# EAGLE schematic untitled (EAGLE 9.6.2)
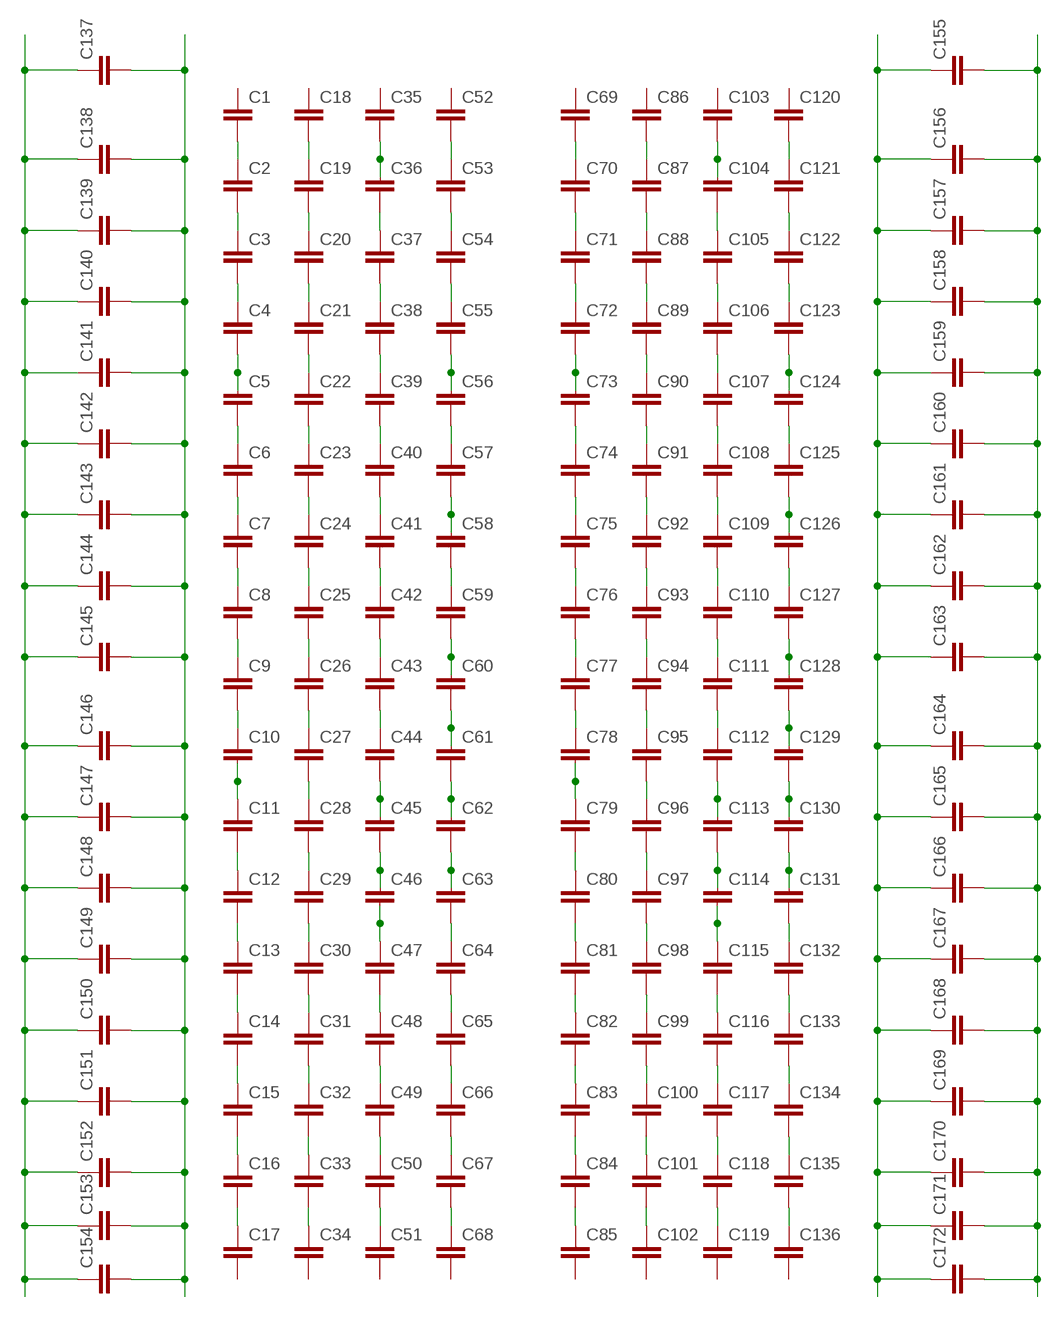
[diagram p0: schematic, sheet 1]

## Parts
C1  C2,5-3  [C2.5-3]
C2  C2,5-3  [C2.5-3]
C3  C2,5-3  [C2.5-3]
C4  C2,5-3  [C2.5-3]
C5  C2,5-3  [C2.5-3]
C6  C2,5-3  [C2.5-3]
C7  C2,5-3  [C2.5-3]
C8  C2,5-3  [C2.5-3]
C9  C2,5-3  [C2.5-3]
C10  C2,5-3  [C2.5-3]
C11  C2,5-3  [C2.5-3]
C12  C2,5-3  [C2.5-3]
C13  C2,5-3  [C2.5-3]
C14  C2,5-3  [C2.5-3]
C15  C2,5-3  [C2.5-3]
C16  C2,5-3  [C2.5-3]
C17  C2,5-3  [C2.5-3]
C18  C2,5-3  [C2.5-3]
C19  C2,5-3  [C2.5-3]
C20  C2,5-3  [C2.5-3]
C21  C2,5-3  [C2.5-3]
C22  C2,5-3  [C2.5-3]
C23  C2,5-3  [C2.5-3]
C24  C2,5-3  [C2.5-3]
C25  C2,5-3  [C2.5-3]
C26  C2,5-3  [C2.5-3]
C27  C2,5-3  [C2.5-3]
C28  C2,5-3  [C2.5-3]
C29  C2,5-3  [C2.5-3]
C30  C2,5-3  [C2.5-3]
C31  C2,5-3  [C2.5-3]
C32  C2,5-3  [C2.5-3]
C33  C2,5-3  [C2.5-3]
C34  C2,5-3  [C2.5-3]
C35  C2,5-3  [C2.5-3]
C36  C2,5-3  [C2.5-3]
C37  C2,5-3  [C2.5-3]
C38  C2,5-3  [C2.5-3]
C39  C2,5-3  [C2.5-3]
C40  C2,5-3  [C2.5-3]
C41  C2,5-3  [C2.5-3]
C42  C2,5-3  [C2.5-3]
C43  C2,5-3  [C2.5-3]
C44  C2,5-3  [C2.5-3]
C45  C2,5-3  [C2.5-3]
C46  C2,5-3  [C2.5-3]
C47  C2,5-3  [C2.5-3]
C48  C2,5-3  [C2.5-3]
C49  C2,5-3  [C2.5-3]
C50  C2,5-3  [C2.5-3]
C51  C2,5-3  [C2.5-3]
C52  C2,5-3  [C2.5-3]
C53  C2,5-3  [C2.5-3]
C54  C2,5-3  [C2.5-3]
C55  C2,5-3  [C2.5-3]
C56  C2,5-3  [C2.5-3]
C57  C2,5-3  [C2.5-3]
C58  C2,5-3  [C2.5-3]
C59  C2,5-3  [C2.5-3]
C60  C2,5-3  [C2.5-3]
C61  C2,5-3  [C2.5-3]
C62  C2,5-3  [C2.5-3]
C63  C2,5-3  [C2.5-3]
C64  C2,5-3  [C2.5-3]
C65  C2,5-3  [C2.5-3]
C66  C2,5-3  [C2.5-3]
C67  C2,5-3  [C2.5-3]
C68  C2,5-3  [C2.5-3]
C69  C2,5-3  [C2.5-3]
C70  C2,5-3  [C2.5-3]
C71  C2,5-3  [C2.5-3]
C72  C2,5-3  [C2.5-3]
C73  C2,5-3  [C2.5-3]
C74  C2,5-3  [C2.5-3]
C75  C2,5-3  [C2.5-3]
C76  C2,5-3  [C2.5-3]
C77  C2,5-3  [C2.5-3]
C78  C2,5-3  [C2.5-3]
C79  C2,5-3  [C2.5-3]
C80  C2,5-3  [C2.5-3]
C81  C2,5-3  [C2.5-3]
C82  C2,5-3  [C2.5-3]
C83  C2,5-3  [C2.5-3]
C84  C2,5-3  [C2.5-3]
C85  C2,5-3  [C2.5-3]
C86  C2,5-3  [C2.5-3]
C87  C2,5-3  [C2.5-3]
C88  C2,5-3  [C2.5-3]
C89  C2,5-3  [C2.5-3]
C90  C2,5-3  [C2.5-3]
C91  C2,5-3  [C2.5-3]
C92  C2,5-3  [C2.5-3]
C93  C2,5-3  [C2.5-3]
C94  C2,5-3  [C2.5-3]
C95  C2,5-3  [C2.5-3]
C96  C2,5-3  [C2.5-3]
C97  C2,5-3  [C2.5-3]
C98  C2,5-3  [C2.5-3]
C99  C2,5-3  [C2.5-3]
C100  C2,5-3  [C2.5-3]
C101  C2,5-3  [C2.5-3]
C102  C2,5-3  [C2.5-3]
C103  C2,5-3  [C2.5-3]
C104  C2,5-3  [C2.5-3]
C105  C2,5-3  [C2.5-3]
C106  C2,5-3  [C2.5-3]
C107  C2,5-3  [C2.5-3]
C108  C2,5-3  [C2.5-3]
C109  C2,5-3  [C2.5-3]
C110  C2,5-3  [C2.5-3]
C111  C2,5-3  [C2.5-3]
C112  C2,5-3  [C2.5-3]
C113  C2,5-3  [C2.5-3]
C114  C2,5-3  [C2.5-3]
C115  C2,5-3  [C2.5-3]
C116  C2,5-3  [C2.5-3]
C117  C2,5-3  [C2.5-3]
C118  C2,5-3  [C2.5-3]
C119  C2,5-3  [C2.5-3]
C120  C2,5-3  [C2.5-3]
C121  C2,5-3  [C2.5-3]
C122  C2,5-3  [C2.5-3]
C123  C2,5-3  [C2.5-3]
C124  C2,5-3  [C2.5-3]
C125  C2,5-3  [C2.5-3]
C126  C2,5-3  [C2.5-3]
C127  C2,5-3  [C2.5-3]
C128  C2,5-3  [C2.5-3]
C129  C2,5-3  [C2.5-3]
C130  C2,5-3  [C2.5-3]
C131  C2,5-3  [C2.5-3]
C132  C2,5-3  [C2.5-3]
C133  C2,5-3  [C2.5-3]
C134  C2,5-3  [C2.5-3]
C135  C2,5-3  [C2.5-3]
C136  C2,5-3  [C2.5-3]
C137  C2,5-3  [C2.5-3]
C138  C2,5-3  [C2.5-3]
C139  C2,5-3  [C2.5-3]
C140  C2,5-3  [C2.5-3]
C141  C2,5-3  [C2.5-3]
C142  C2,5-3  [C2.5-3]
C143  C2,5-3  [C2.5-3]
C144  C2,5-3  [C2.5-3]
C145  C2,5-3  [C2.5-3]
C146  C2,5-3  [C2.5-3]
C147  C2,5-3  [C2.5-3]
C148  C2,5-3  [C2.5-3]
C149  C2,5-3  [C2.5-3]
C150  C2,5-3  [C2.5-3]
C151  C2,5-3  [C2.5-3]
C152  C2,5-3  [C2.5-3]
C153  C2,5-3  [C2.5-3]
C154  C2,5-3  [C2.5-3]
C155  C2,5-3  [C2.5-3]
C156  C2,5-3  [C2.5-3]
C157  C2,5-3  [C2.5-3]
C158  C2,5-3  [C2.5-3]
C159  C2,5-3  [C2.5-3]
C160  C2,5-3  [C2.5-3]
C161  C2,5-3  [C2.5-3]
C162  C2,5-3  [C2.5-3]
C163  C2,5-3  [C2.5-3]
C164  C2,5-3  [C2.5-3]
C165  C2,5-3  [C2.5-3]
C166  C2,5-3  [C2.5-3]
C167  C2,5-3  [C2.5-3]
C168  C2,5-3  [C2.5-3]
C169  C2,5-3  [C2.5-3]
C170  C2,5-3  [C2.5-3]
C171  C2,5-3  [C2.5-3]
C172  C2,5-3  [C2.5-3]

## Nets
N$1: C1.2 C2.1
N$2: C2.2 C3.1
N$3: C3.2 C4.1
N$4: C4.2 C5.1
N$5: C16.2 C17.1
N$6: C15.2 C16.1
N$7: C14.2 C15.1
N$8: C13.2 C14.1
N$9: C12.2 C13.1
N$10: C11.2 C12.1
N$11: C10.2 C11.1
N$12: C5.2 C6.1
N$13: C6.2 C7.1
N$14: C7.2 C8.1
N$15: C8.2 C9.1
N$16: C9.2 C10.1
N$17: C18.2 C19.1
N$18: C19.2 C20.1
N$19: C20.2 C21.1
N$20: C21.2 C22.1
N$21: C22.2 C23.1
N$22: C23.2 C24.1
N$23: C24.2 C25.1
N$24: C25.2 C26.1
N$25: C26.2 C27.1
N$26: C27.2 C28.1
N$27: C28.2 C29.1
N$28: C29.2 C30.1
N$29: C30.2 C31.1
N$30: C47.2 C48.1
N$31: C46.2 C47.1
N$32: C40.2 C41.1
N$33: C41.2 C42.1
N$34: C42.2 C43.1
N$35: C43.2 C44.1
N$36: C44.2 C45.1
N$37: C45.2 C46.1
N$38: C52.2 C53.1
N$39: C53.2 C54.1
N$40: C54.2 C55.1
N$41: C55.2 C56.1
N$42: C56.2 C57.1
N$43: C57.2 C58.1
N$44: C58.2 C59.1
N$45: C59.2 C60.1
N$46: C60.2 C61.1
N$47: C61.2 C62.1
N$48: C62.2 C63.1
N$49: C63.2 C64.1
N$50: C64.2 C65.1
N$51: C35.2 C36.1
N$52: C31.2 C32.1
N$53: C48.2 C49.1
N$54: C65.2 C66.1
N$55: C33.2 C34.1
N$56: C32.2 C33.1
N$57: C49.2 C50.1
N$58: C66.2 C67.1
N$59: C67.2 C68.1
N$60: C50.2 C51.1
N$61: C37.2 C38.1
N$62: C36.2 C37.1
N$63: C38.2 C39.1
N$64: C39.2 C40.1
N$65: C69.2 C70.1
N$66: C70.2 C71.1
N$67: C71.2 C72.1
N$68: C72.2 C73.1
N$69: C84.2 C85.1
N$70: C83.2 C84.1
N$71: C82.2 C83.1
N$72: C81.2 C82.1
N$73: C80.2 C81.1
N$74: C79.2 C80.1
N$75: C78.2 C79.1
N$76: C73.2 C74.1
N$77: C74.2 C75.1
N$78: C75.2 C76.1
N$79: C76.2 C77.1
N$80: C77.2 C78.1
N$81: C86.2 C87.1
N$82: C87.2 C88.1
N$83: C88.2 C89.1
N$84: C89.2 C90.1
N$85: C90.2 C91.1
N$86: C91.2 C92.1
N$87: C92.2 C93.1
N$88: C93.2 C94.1
N$89: C94.2 C95.1
N$90: C95.2 C96.1
N$91: C96.2 C97.1
N$92: C97.2 C98.1
N$93: C98.2 C99.1
N$94: C115.2 C116.1
N$95: C114.2 C115.1
N$96: C108.2 C109.1
N$97: C109.2 C110.1
N$98: C110.2 C111.1
N$99: C111.2 C112.1
N$100: C112.2 C113.1
N$101: C113.2 C114.1
N$102: C120.2 C121.1
N$103: C121.2 C122.1
N$104: C122.2 C123.1
N$105: C123.2 C124.1
N$106: C124.2 C125.1
N$107: C125.2 C126.1
N$108: C126.2 C127.1
N$109: C127.2 C128.1
N$110: C128.2 C129.1
N$111: C129.2 C130.1
N$112: C130.2 C131.1
N$113: C131.2 C132.1
N$114: C132.2 C133.1
N$115: C103.2 C104.1
N$116: C99.2 C100.1
N$117: C116.2 C117.1
N$118: C133.2 C134.1
N$119: C101.2 C102.1
N$120: C100.2 C101.1
N$121: C117.2 C118.1
N$122: C134.2 C135.1
N$123: C135.2 C136.1
N$124: C118.2 C119.1
N$125: C105.2 C106.1
N$126: C104.2 C105.1
N$127: C106.2 C107.1
N$128: C107.2 C108.1
N$129: C137.1 C138.1 C139.1 C140.1 C141.1 C142.1 C143.1 C144.1 C145.1 C146.1 C147.1 C148.1 C149.1 C150.1 C151.1 C152.1 C153.1 C154.1
N$130: C155.1 C156.1 C157.1 C158.1 C159.1 C160.1 C161.1 C162.1 C163.1 C164.1 C165.1 C166.1 C167.1 C168.1 C169.1 C170.1 C171.1 C172.1
N$131: C137.2 C138.2 C139.2 C140.2 C141.2 C142.2 C143.2 C144.2 C145.2 C146.2 C147.2 C148.2 C149.2 C150.2 C151.2 C152.2 C153.2 C154.2
N$132: C155.2 C156.2 C157.2 C158.2 C159.2 C160.2 C161.2 C162.2 C163.2 C164.2 C165.2 C166.2 C167.2 C168.2 C169.2 C170.2 C171.2 C172.2
Unconnected: C1.1 C17.2 C18.1 C34.2 C35.1 C51.2 C52.1 C68.2 C69.1 C85.2 C86.1 C102.2 C103.1 C119.2 C120.1 C136.2

## Library data of the parts
C1-C172 = capacitor-wima:C: CAPACITOR naming: grid - package width